# Altium schematic sheet OpenBCI Hyperscanning.SchDoc
size A
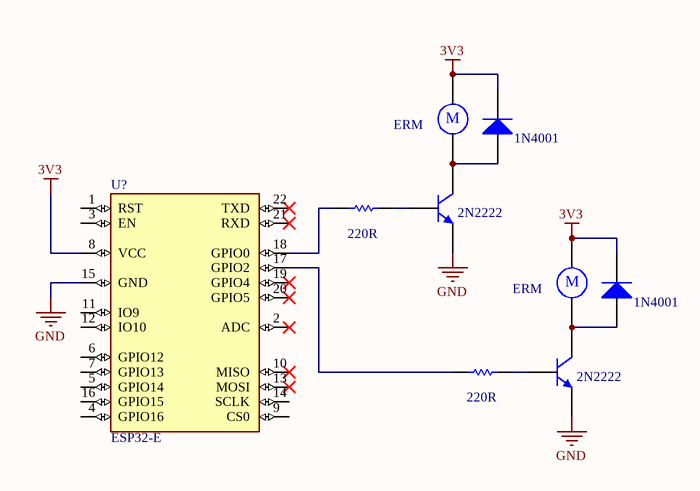
[diagram p0: OpenBCI Hyperscanning.SchDoc]

## Parts
(Parts that share a designator on the sheet are numbered #1, #2 ... from top to bottom, then left to right.)
B?#1  ERM  [RB5-10.5]
B?#2  ERM  [RB5-10.5]
D?#1  1N4001  [SMC]
D?#2  1N4001  [SMC]
Q?#1  2N2222  [TO-92A]
Q?#2  2N2222  [TO-92A]
R?#1  value 220R  [AXIAL-0.3]  (hidden comment: Res1)
R?#2  value 220R  [AXIAL-0.3]  (hidden comment: Res1)
U?  ESP32-E  [ESP-12F]

## Nets
3V3: B?#1.1 B?#2.1 D?#1.2(K) D?#2.2(K) U?.8(VCC)
GND: Q?#1.1(E) Q?#2.1(E) U?.15(GND)
NetB?#1_2: B?#1.2 D?#1.1(A) Q?#1.3(C)
NetB?#2_2: B?#2.2 D?#2.1(A) Q?#2.3(C)
NetQ?#1_2: Q?#1.2(B) R?#1.2
NetQ?#2_2: Q?#2.2(B) R?#2.2
NetR?#1_1: R?#1.1 U?.18(GPIO0)
NetR?#2_1: R?#2.1 U?.17(GPIO2)

Not connected (* = marked no-connect by the designer): U? 1(RST) 2(ADC)* 3(EN) 4(GPIO16) 5(GPIO14) 6(GPIO12) 7(GPIO13) 9(CS0) 10(MISO)* 11(IO9) 12(IO10) 13(MOSI)* 14(SCLK) 16(GPIO15) 19(GPIO4)* 20(GPIO5)* 21(RXD)* 22(TXD)*

## Notes on the sheet
- (in symbol Motor) M

## Library data of the parts
B?#1 B?#2 = Motor: Motor, General Kind; Published: 24-Mar-1999; LatestRevisionDate: 17-Jul-2002; LatestRevisionNote: Re-released for DXP Platform.; PackageReference: RB5-10.5; Publisher: Altium Limited; PackageDescription: Capacitor (Radial); 2 Leads
D?#1 D?#2 = Diode: Default Diode; Published: 8-Jun-2000; LatestRevisionDate: 17-Jul-2002; LatestRevisionNote: Re-released for DXP Platform.; PackageVersion: Sep-1996; PackageReference: SMC; Publisher: Altium Limited; PackageDescription: DO-214-AB/SMC; 2 C-Bend Leads; Body 7.9 x 5.9 mm, inc. leads (LxW); Code_JEDEC: DO-214-AB
Q?#1 Q?#2 = 2N3904: NPN General Purpose Amplifier; Published: 8-Jun-2000; LatestRevisionDate: 15-Jan-2003; LatestRevisionNote: PCB Footprint 'BCY-W3/D4.7' replaced; DatasheetVersion: 1997; PackageVersion: Sep-1998; PackageReference: TO-92A; Publisher: Altium Limited; PackageDescription: TO, Flat Index; 3 In-Line, Axial Leads; Body Dia. 4.5mm; Leads 0.51 x 0.48 mm (max); ComponentLink1Description: Manufacturer Link; ComponentLink1URL: http://www.fairchildsemi.com/; ComponentLink2Description: Datasheet; ComponentLink2URL: http://www.fairchildsemi.com/ds/2N%2F2N3904.pdf
R?#1 R?#2 = Res1: Resistor; Published: 8-Jun-2000; LatestRevisionDate: 17-Jul-2002; LatestRevisionNote: Re-released for DXP Platform.; PackageReference: AXIAL-0.3; Publisher: Altium Limited; PackageDescription: Axial Device, Thru-Hole; 2 Leads; 0.3 in Pin Spacing
U? = ESP-12F: WiFi Module; MF: AI-Thinker; Price: None; SnapEDA_Link: https://www.snapeda.com/parts/ESP-12F/AI-Thinker/view-part/6648243/?ref=snap; Check_prices: https://www.snapeda.com/parts/ESP-12F/AI-Thinker/view-part/6648243/?ref=eda; Availability: No availability data; Value: *; MP: ESP-12F; Package: Package